# EAGLE design sensor_t° (EAGLE 9.6.2)
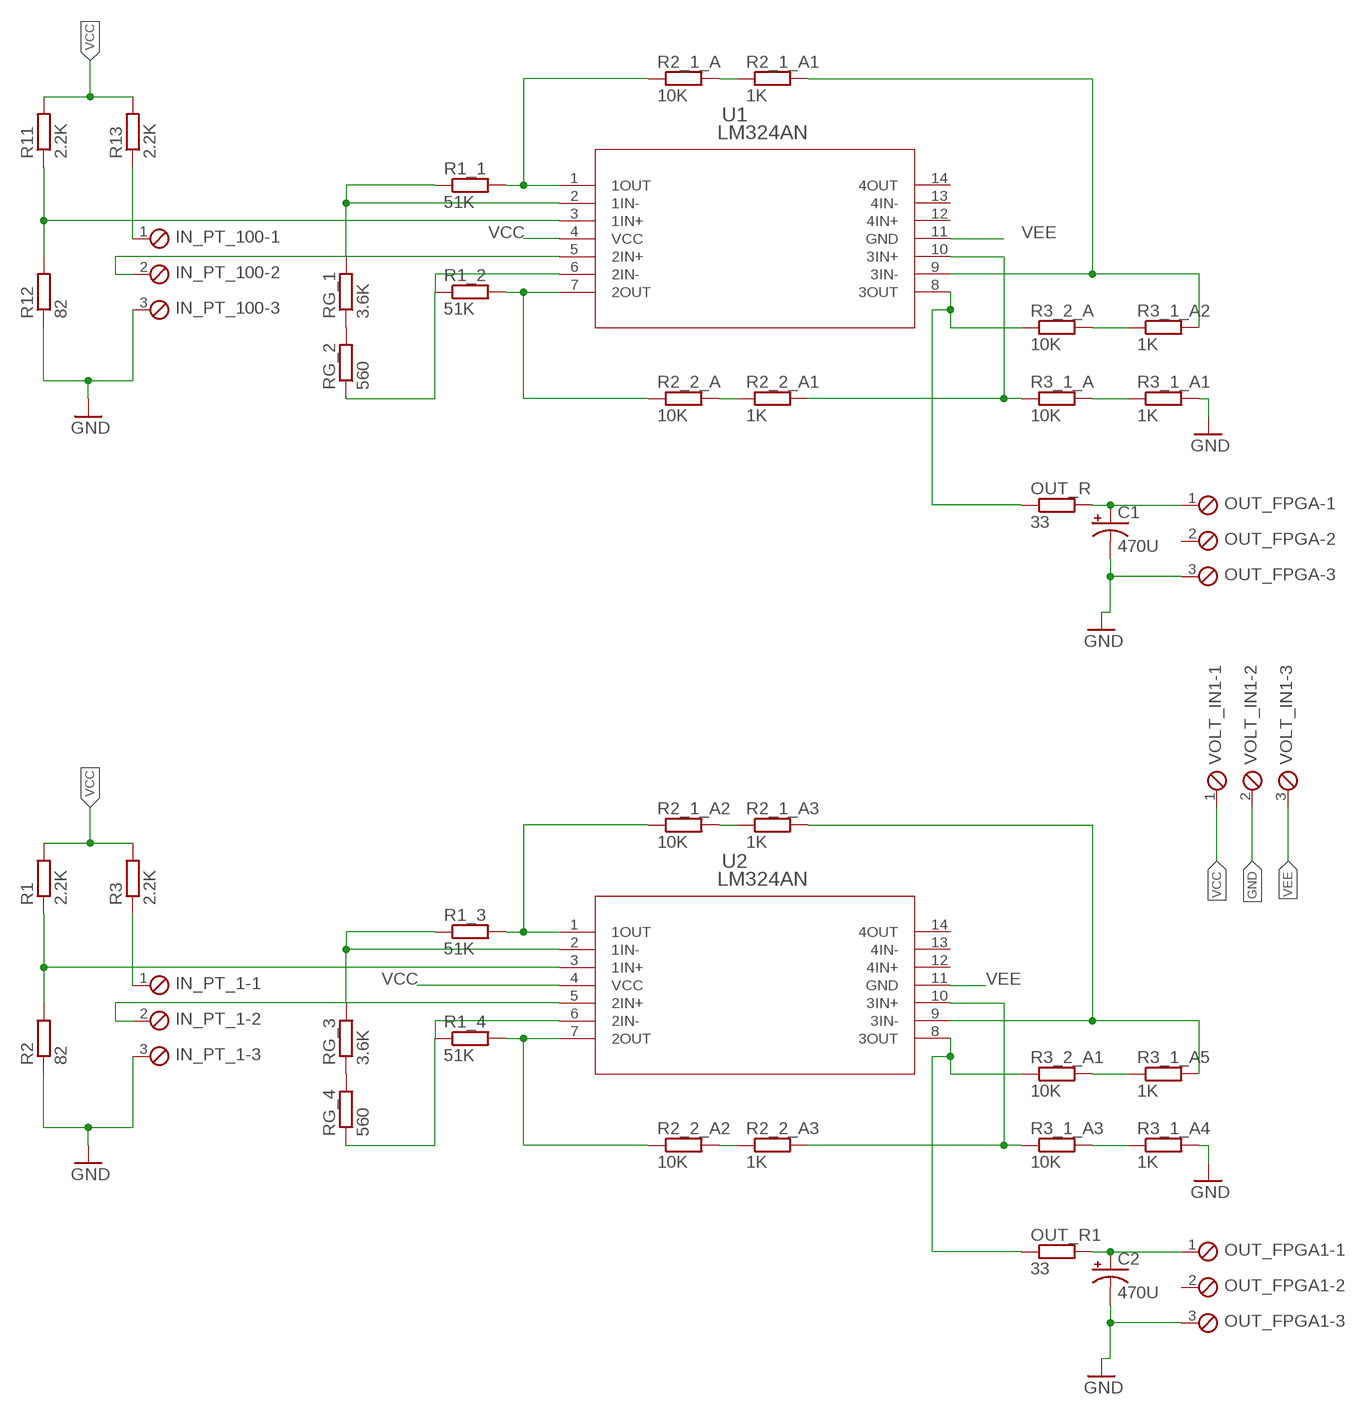
[diagram p0: schematic, sheet 1]

## Parts
C1  470U  CPOL-USTAP5-80  [TAP5-80]
C2  470U  CPOL-USTAP5-80  [TAP5-80]
IN_PT_1  MPT3  [3POL254]
IN_PT_100  MPT3  [3POL254]
OUT_FPGA  MPT3  [3POL254]
OUT_FPGA1  MPT3  [3POL254]
OUT_R  33  R-EU_0207/10  [0207/10]
OUT_R1  33  R-EU_0207/10  [0207/10]
R1  2.2K  R-EU_0207/10  [0207/10]
R1_1  51K  R-EU_0207/10  [0207/10]
R1_2  51K  R-EU_0207/10  [0207/10]
R1_3  51K  R-EU_0207/10  [0207/10]
R1_4  51K  R-EU_0207/10  [0207/10]
R2  82  R-EU_0207/10  [0207/10]
R2_1_A  10K  R-EU_0207/10  [0207/10]
R2_1_A1  1K  R-EU_0207/10  [0207/10]
R2_1_A2  10K  R-EU_0207/10  [0207/10]
R2_1_A3  1K  R-EU_0207/10  [0207/10]
R2_2_A  10K  R-EU_0207/10  [0207/10]
R2_2_A1  1K  R-EU_0207/10  [0207/10]
R2_2_A2  10K  R-EU_0207/10  [0207/10]
R2_2_A3  1K  R-EU_0207/10  [0207/10]
R3  2.2K  R-EU_0207/10  [0207/10]
R3_1_A  10K  R-EU_0207/10  [0207/10]
R3_1_A1  1K  R-EU_0207/10  [0207/10]
R3_1_A2  1K  R-EU_0207/10  [0207/10]
R3_1_A3  10K  R-EU_0207/10  [0207/10]
R3_1_A4  1K  R-EU_0207/10  [0207/10]
R3_1_A5  1K  R-EU_0207/10  [0207/10]
R3_2_A  10K  R-EU_0207/10  [0207/10]
R3_2_A1  10K  R-EU_0207/10  [0207/10]
R11  2.2K  R-EU_0207/10  [0207/10]
R12  82  R-EU_0207/10  [0207/10]
R13  2.2K  R-EU_0207/10  [0207/10]
RG_1  3.6K  R-EU_0207/10  [0207/10]
RG_2  560  R-EU_0207/10  [0207/10]
RG_3  3.6K  R-EU_0207/10  [0207/10]
RG_4  560  R-EU_0207/10  [0207/10]
U1  LM324AN  [N14]
U2  LM324AN  [N14]
VOLT_IN1  MPT3  [3POL254]

## Nets
GND: C1.- C2.- IN_PT_1.3 IN_PT_100.3 OUT_FPGA1.3 OUT_FPGA.3 R2.1 R3_1_A1.2 R3_1_A4.2 R12.1 VOLT_IN1.2
N$1: R11.1 R12.2 U1.3(1IN+)
N$2: IN_PT_100.1 R13.1
N$3: RG_1.1 RG_2.2
N$4: R1_1.2 R2_1_A.1 U1.1(1OUT)
N$5: R2_1_A1.1 R2_1_A.2
N$6: R2_1_A1.2 R3_1_A2.2 U1.9(3IN-)
N$7: R1_2.2 R2_2_A.1 U1.7(2OUT)
N$8: R1_1.1 RG_1.2 U1.2(1IN-)
N$9: R1_2.1 RG_2.1 U1.6(2IN-)
N$10: R2_2_A1.1 R2_2_A.2
N$11: R2_2_A1.2 R3_1_A.1 U1.10(3IN+)
N$12: OUT_R.1 R3_2_A.1 U1.8(3OUT)
N$13: R3_1_A2.1 R3_2_A.2
N$14: R3_1_A1.1 R3_1_A.2
N$15: C1.+ OUT_FPGA.1 OUT_R.2
N$16: IN_PT_100.2 U1.5(2IN+)
N$17: RG_3.1 RG_4.2
N$18: R1_3.2 R2_1_A2.1 U2.1(1OUT)
N$19: R2_1_A2.2 R2_1_A3.1
N$20: R2_1_A3.2 R3_1_A5.2 U2.9(3IN-)
N$21: R1_3.1 RG_3.2 U2.2(1IN-)
N$22: R1_4.2 R2_2_A2.1 U2.7(2OUT)
N$23: R1_4.1 RG_4.1 U2.6(2IN-)
N$24: R2_2_A2.2 R2_2_A3.1
N$25: R2_2_A3.2 R3_1_A3.1 U2.10(3IN+)
N$26: OUT_R1.1 R3_2_A1.1 U2.8(3OUT)
N$27: R3_1_A5.1 R3_2_A1.2
N$28: R3_1_A3.2 R3_1_A4.1
N$29: C2.+ OUT_FPGA1.1 OUT_R1.2
N$30: R1.1 R2.2 U2.3(1IN+)
N$31: IN_PT_1.1 R3.1
N$32: IN_PT_1.2 U2.5(2IN+)
VCC: R1.2 R3.2 R11.2 R13.2 U1.4(VCC) U2.4(VCC) VOLT_IN1.1
VEE: U1.11(GND) U2.11(GND) VOLT_IN1.3
Unconnected: OUT_FPGA1.2 OUT_FPGA.2 U1.12(4IN+) U1.13(4IN-) U1.14(4OUT) U2.12(4IN+) U2.13(4IN-) U2.14(4OUT)

## Library data of the parts
C1 C2 = rcl:CPOL-US: POLARIZED CAPACITOR, American symbol; SPICEPREFIX: C
IN_PT_1 IN_PT_100 OUT_FPGA OUT_FPGA1 VOLT_IN1 = con-phoenix-254:MPT3: PHOENIX CONNECTOR; OC_FARNELL: unknown; OC_NEWARK: unknown
OUT_R OUT_R1 R1 R1_1-R1_4 R2 R2_1_A R2_1_A1-R2_1_A3 R2_2_A R2_2_A1-R2_2_A3 R3 R3_1_A R3_1_A1-R3_1_A5 R3_2_A R3_2_A1 R11-R13 RG_1-RG_4 = rcl:R-EU_: RESISTOR, European symbol; SPICEPREFIX: R
U1 U2 = lm324_14dip:LM324AN; COPYRIGHT: Copyright (C) 2023 Ultra Librarian. All rights reserved.; MANUFACTURER_PART_NUMBER: LM324AN; MFR_NAME: Texas Instruments

## Board
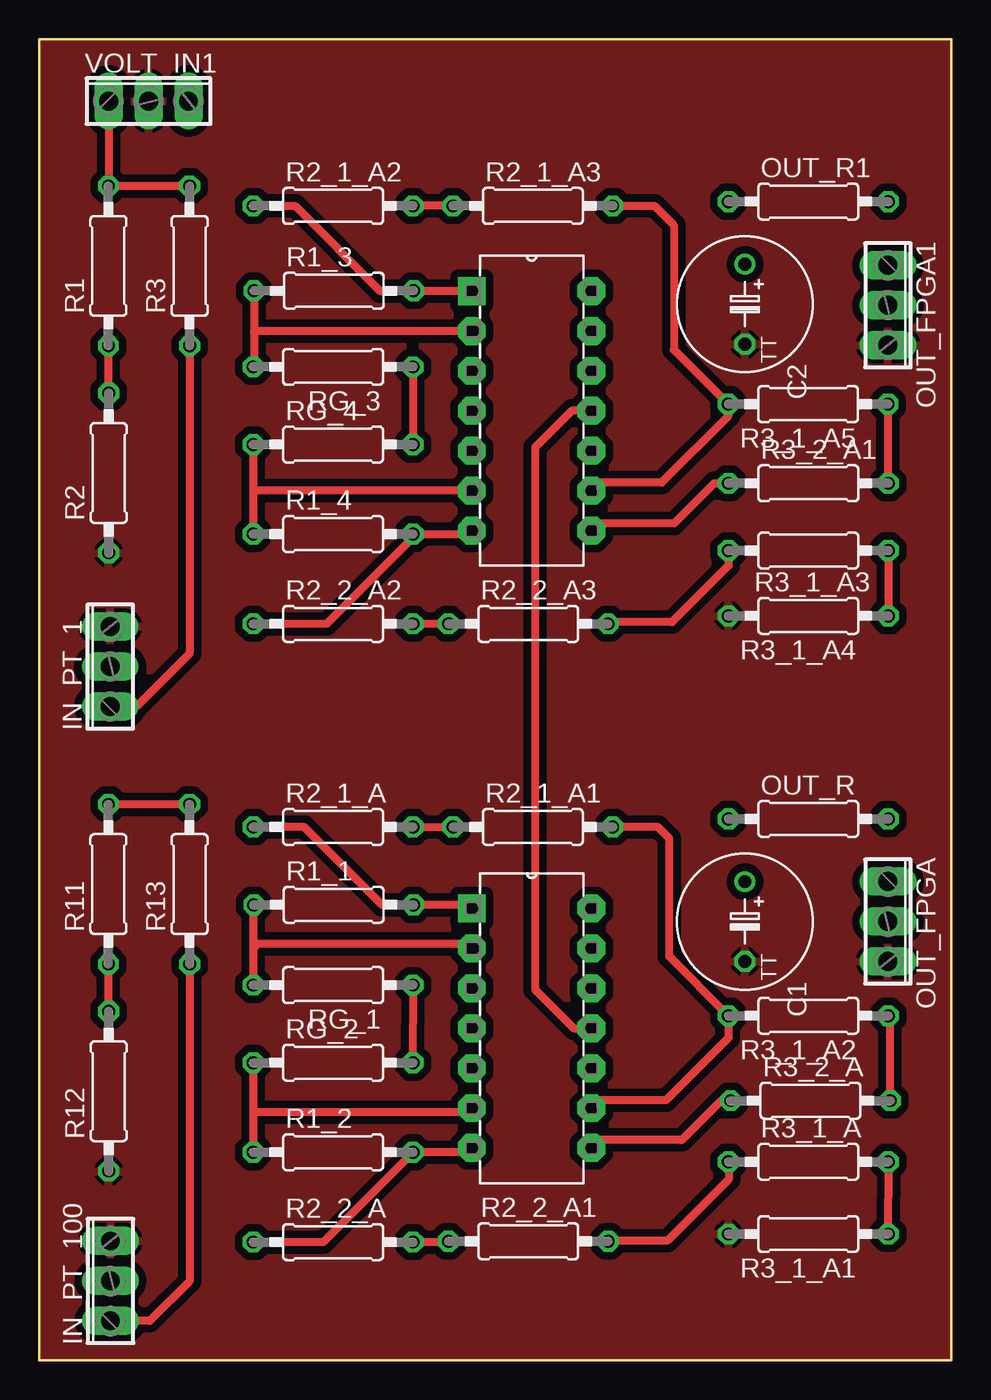
[diagram p1: board, top side]
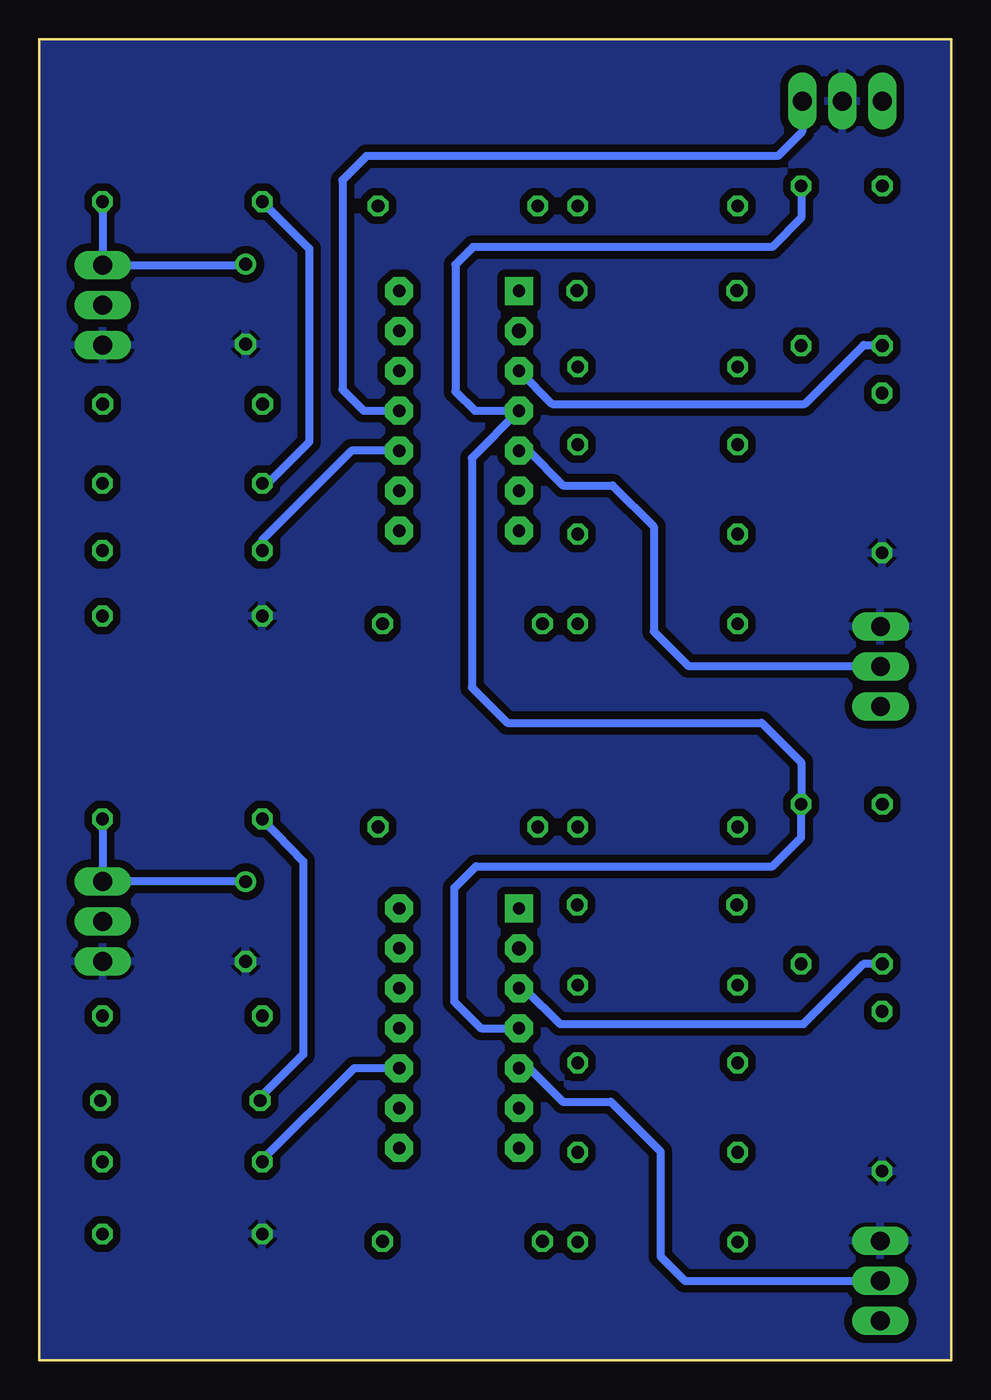
[diagram p2: board, bottom side, seen from below]

Size 58.01 x 83.99 mm. Coordinates in mm from the lower left corner, seen from the top.
Outline: 0,0 0,83.99 58.01,83.99 58.01,0 0,0
Copper layers (1*16): Top 0.035mm / dielectric 1.5mm / Bottom 0.035mm
Design rules "default *": minimum track width 6mil, minimum drill 0.35mm, track to track 0.5mm, track to pad 0.5mm, pad to pad 6mil, via to via 6mil, smd to smd 6mil, copper to edge 0.001mm, drill to drill 6mil, minimum pad ring 10mil, minimum via ring 8mil, stop-mask expansion 4mil, vias tented up to drill 0mil, thermal gap 10mil

### Footprints (pad centres in the part's own frame; a part is rotated, then mirrored left to right if it is on the bottom)
TAP5-80 = drill 0.813: + -2.54,0 | drill 0.813 octagon: - 2.54,0
3POL254 = drill 1.2 long: 1 -2.54,0; 2 0,0; 3 2.54,0
0207/10 = drill 0.813 octagon: 1 -5.08,0; 2 5.08,0
N14 = drill 0.787 pad 1.778 square: 1 -7.62,15.24 | drill 0.9 pad 1.778 octagon: 2 -7.62,12.7 | drill 0.787 pad 1.778 octagon: 3 -7.62,10.16; 4 -7.62,7.62; 5 -7.62,5.08; 6 -7.62,2.54; 7 -7.62,0; 8 0,0; 9 0,2.54; 10 0,5.08; 11 0,7.62; 12 0,10.16; 13 0,12.7; 14 0,15.24

### Placement (x,y rotation side)
C1  44.88,27.89 270 top
C2  44.88,67.15 270 top
IN_PT_1  4.51,44.11 90 top
IN_PT_100  4.53,5.04 90 top
OUT_FPGA  53.97,27.89 270 top
OUT_FPGA1  53.97,67.09 270 top
OUT_R  48.91,34.41 0 top
OUT_R1  48.91,73.67 0 top
R1  4.39,69.59 90 top
R1_1  18.72,28.96 0 top
R1_2  18.68,13.22 0 top
R1_3  18.73,68 0 top
R1_4  18.68,52.53 0 top
R2  4.41,56.41 90 top
R2_1_A  18.68,33.91 0 top
R2_1_A1  31.39,33.91 0 top
R2_1_A2  18.68,73.4 0 top
R2_1_A3  31.39,73.4 0 top
R2_2_A  18.68,7.51 0 top
R2_2_A1  31.1,7.56 0 top
R2_2_A2  18.68,46.82 0 top
R2_2_A3  31.1,46.82 0 top
R3  9.56,69.59 90 top
R3_1_A  48.91,12.61 0 top
R3_1_A1  48.91,8.02 180 top
R3_1_A2  48.91,21.9 180 top
R3_1_A3  48.91,51.49 0 top
R3_1_A4  48.91,47.33 180 top
R3_1_A5  48.89,60.79 180 top
R3_2_A  49.04,16.5 0 top
R3_2_A1  48.91,55.76 0 top
R11  4.39,30.27 90 top
R12  4.41,17.1 90 top
R13  9.56,30.27 90 top
RG_1  18.68,23.85 180 top
RG_2  18.68,18.91 0 top
RG_3  18.68,63.16 180 top
RG_4  18.68,58.22 0 top
U1  35.12,13.49 0 top
U2  35.12,52.75 0 top
VOLT_IN1  6.94,80.07 0 top

### Tracks (layer width: path | path; a pad name or v marks a point on that pad's centre or on a via)
GND
  pour Top: -4.14,-1.64 -4.14,87.91 67.38,87.91 67.38,-1.64
  pour Bottom: -3.8,-1.73 -3.8,87.11 68.16,87.11 68.16,-1.73
N$1
  Top 0.508: R11.1 4.39,22.2 R12.2
  Bottom 0.508: R11.1 5.59,25.19 9.41,21.37 24.9,21.37 27.17,23.65 U1.3
N$2
  Top 0.508: R13.1 9.56,5.03 7.03,2.5 IN_PT_100.1
N$3
  Top 0.508: RG_1.1 23.75,18.93 RG_2.2
N$4
  Top 0.508: U1.1 27.28,28.96 R1_1.2 21.79,28.96 16.84,33.91 R2_1_A.1
N$5
  Top 0.508: R2_1_A.2 R2_1_A1.1
N$6
  Top 0.508: U1.9 35.63,16.54 39.86,16.54 43.83,20.51 R3_1_A2.2 40.07,25.66 40.07,33.19 39.35,33.91 R2_1_A1.2
N$7
  Top 0.508: U1.7 27.23,13.22 R1_2.2 18.05,7.51 R2_2_A.1
N$8
  Top 0.508: R1_1.1 13.6,28.92 13.6,26.18 | 13.6,26.18 RG_1.2 | U1.2 27.23,26.46 13.88,26.46 13.6,26.18
N$9
  Top 0.508: RG_2.1 13.6,15.75 | 13.6,15.75 R1_2.1 | U1.6 27.22,15.75 13.6,15.75
N$10
  Top 0.508: R2_2_A1.1 25.96,7.51 R2_2_A.2
N$11
  Top 0.508: R3_1_A.1 43.85,11.51 39.93,7.6 36.21,7.6 R2_2_A1.2
  Bottom 0.508: R3_1_A.1 43.83,12.73 37.99,18.57 U1.10
N$12
  Top 0.508: R3_2_A.1 43.36,16.5 40.86,14 35.63,14 U1.8
  Bottom 0.508: OUT_R.1 41.22,31.72 41.22,19.44 43.96,16.7 R3_2_A.1
N$13
  Top 0.508: R3_2_A.2 54.09,16.5 54.09,21.79 R3_1_A2.1
N$14
  Top 0.508: R3_1_A1.1 54.02,12.61 R3_1_A.2
N$15
  Bottom 0.508: C1.+ OUT_FPGA.1 OUT_R.2
N$16
  Bottom 0.508: IN_PT_100.2 16.94,5.04 18.5,6.61 18.5,13.27 21.67,16.43 24.71,16.43 26.85,18.57 U1.5
N$17
  Top 0.508: RG_3.1 RG_4.2
N$18
  Top 0.508: U2.1 23.82,67.99 | 23.82,67.99 R1_3.2 | R2_1_A2.1 16.26,73.4 21.67,67.99 23.82,67.99
N$19
  Top 0.508: R2_1_A3.1 R2_1_A2.2
N$20
  Top 0.508: R2_1_A3.2 39.11,73.4 40.35,72.16 40.35,64.26 R3_1_A5.2 43.81,60.04 39.57,55.8 35.63,55.8 U2.9
N$21
  Top 0.508: R1_3.1 13.65,65.4 | 13.65,65.4 13.65,63.21 RG_3.2 | U2.2 13.7,65.45 13.65,65.4
N$22
  Top 0.508: U2.7 27.29,52.53 R1_4.2 23.76,52.3 18.29,46.82 R2_2_A2.1
N$23
  Top 0.508: RG_4.1 13.6,55.31 | 13.6,55.31 R1_4.1 | U2.6 13.62,55.29 13.6,55.31
N$24
  Top 0.508: R2_2_A3.1 R2_2_A2.2
N$25
  Top 0.508: R3_1_A3.1 43.83,50.52 40.24,46.93 36.29,46.93 R2_2_A3.2
  Bottom 0.508: U2.10 38.15,57.83 43.83,52.16 R3_1_A3.1
N$26
  Top 0.508: U2.8 35.58,53.2 40.37,53.2 42.93,55.76 R3_2_A1.1
  Bottom 0.508: OUT_R1.1 40.84,70.69 40.84,58.39 43.47,55.76 R3_2_A1.1
N$27
  Top 0.508: R3_1_A5.1 53.97,55.78 R3_2_A1.2
N$28
  Top 0.508: R3_1_A3.2 R3_1_A4.1
N$29
  Bottom 0.508: OUT_R1.2 53.99,69.64 OUT_FPGA1.1 44.95,69.63 C2.+
N$30
  Top 0.508: R1.1 4.39,61.51 R2.2
  Bottom 0.508: U2.3 25.4,60.81 9.32,60.81 5.58,64.55 4.43,64.55 R1.1
N$31
  Top 0.508: R3.1 9.56,44.94 6.19,41.57 IN_PT_1.1
N$32
  Bottom 0.508: U2.5 26.91,57.83 24.71,55.62 21.55,55.62 18.93,53 18.93,46.34 16.74,44.15 4.55,44.15 IN_PT_1.2
VCC
  Top 0.508: R13.2 R11.2 | VOLT_IN1.1 R1.2 R3.2
  Bottom 0.508: U1.4 29.93,21.11 31.61,22.79 31.61,30.03 30.23,31.41 11.38,31.41 9.56,33.23 R13.2 9.56,38.02 12.06,40.53 28.24,40.53 30.5,42.78 30.5,57.38 U2.4 30.31,60.37 31.54,61.6 31.54,69.68 30.43,70.79 11.4,70.79 9.56,72.64 R3.2
VEE
  Top 0.508: U2.11 33.86,60.37 31.53,58.04 31.53,23.57 34,21.11 U1.11
  Bottom 0.508: VOLT_IN1.3 9.48,78.13 11.05,76.56 37.21,76.56 38.73,75.04 38.73,61.72 37.38,60.37 U2.11